# Altium schematic sheet Mako DSP Audio Codec R2.1.SchDoc
size B
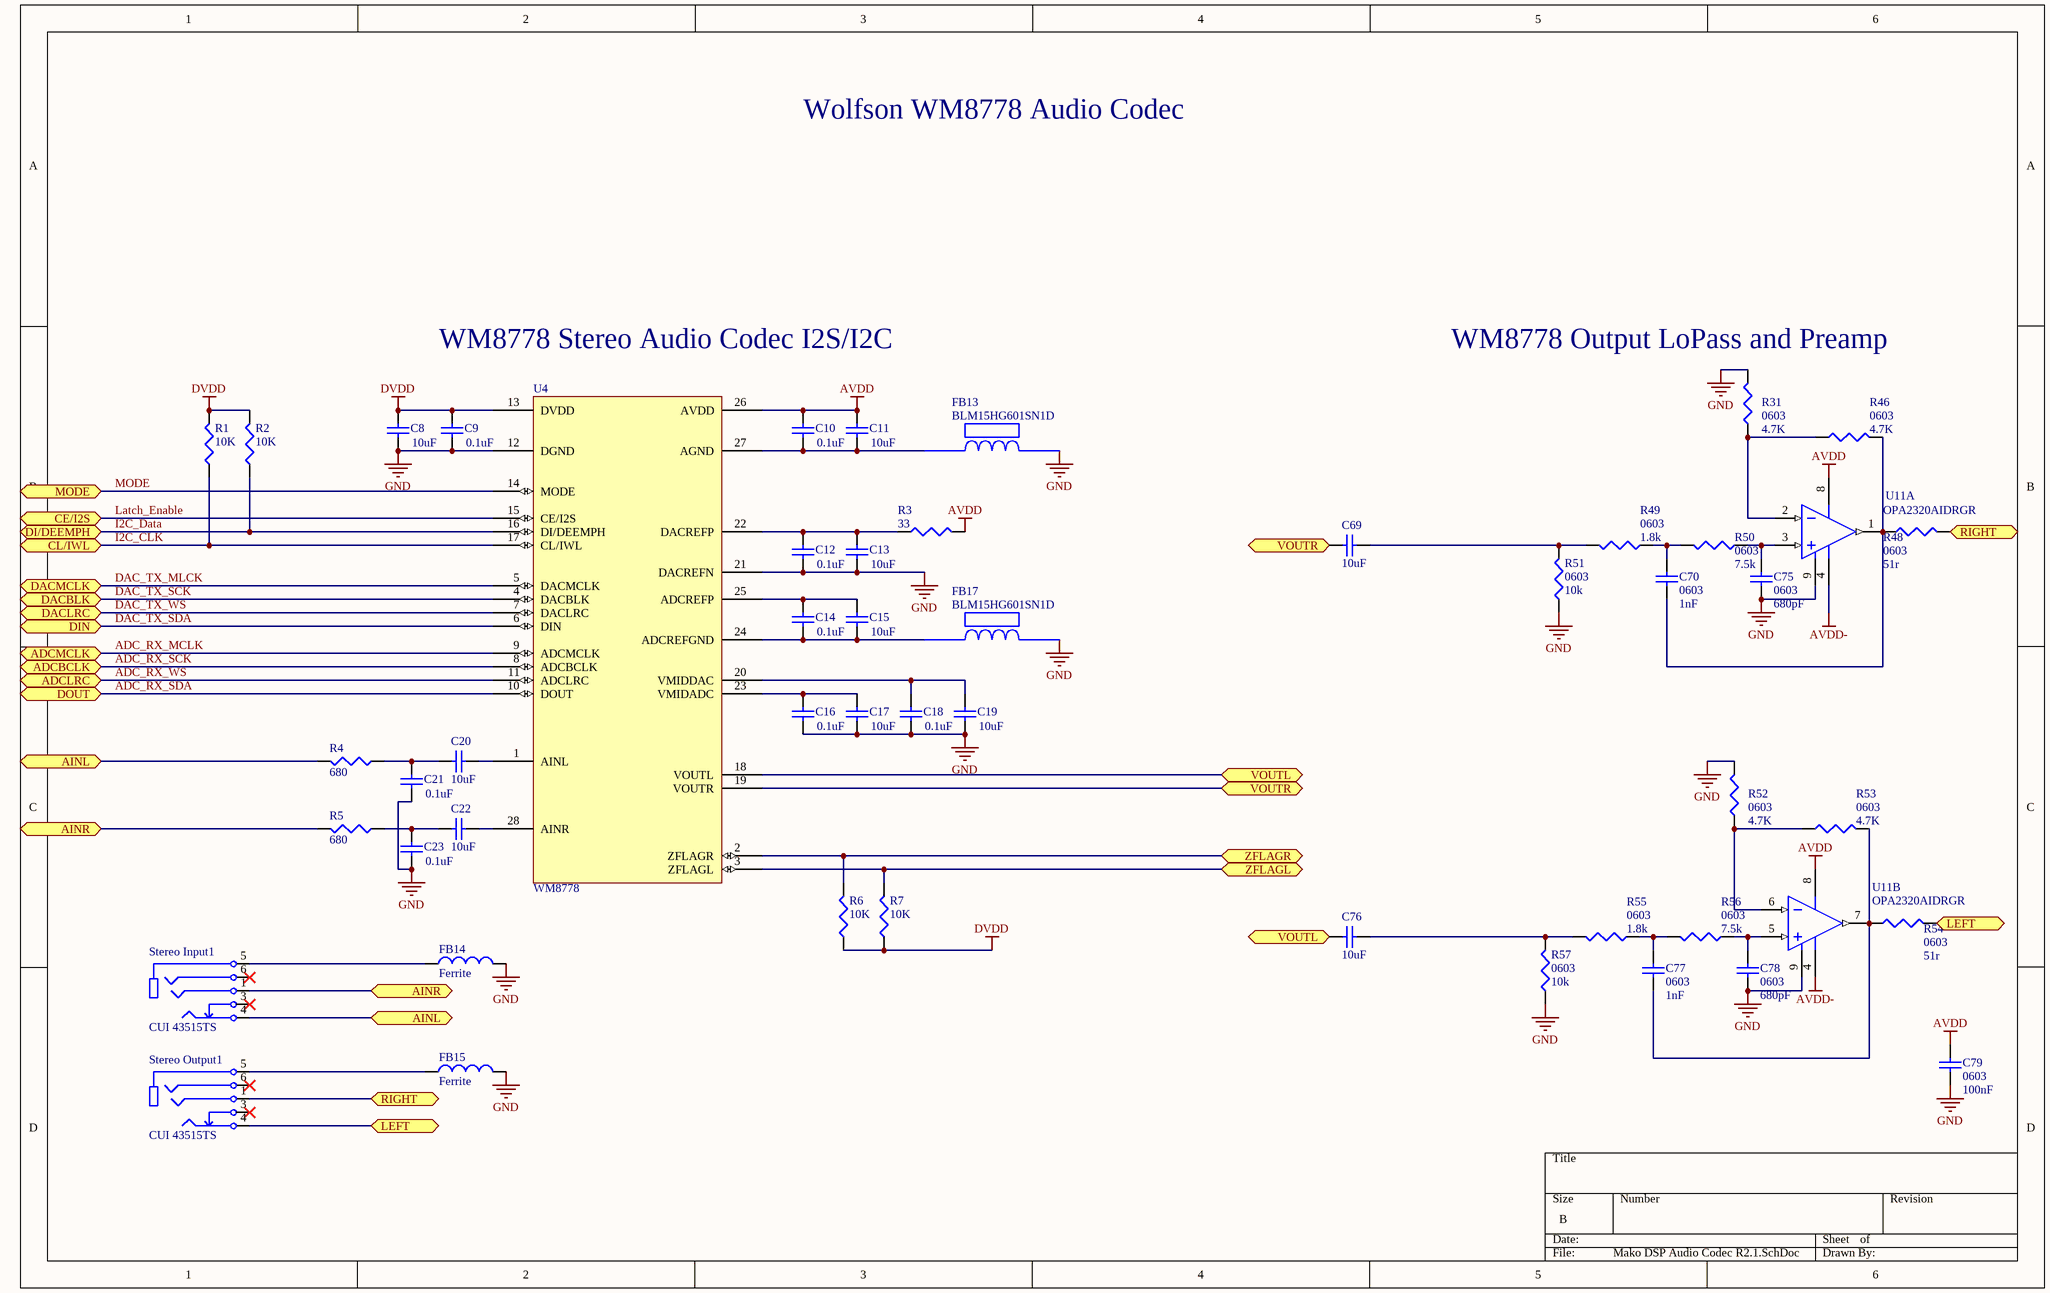
[diagram p0: Mako DSP Audio Codec R2.1.SchDoc]

## Parts
C8  value 10uF  [1608[0603]]  (hidden comment: Cap Semi)
C9  value 0.1uF  [1608[0603]]  (hidden comment: Cap Semi)
C10  value 0.1uF  [1608[0603]]  (hidden comment: Cap Semi)
C11  value 10uF  [1608[0603]]  (hidden comment: Cap Semi)
C12  value 0.1uF  [1608[0603]]  (hidden comment: Cap Semi)
C13  value 10uF  [1608[0603]]  (hidden comment: Cap Semi)
C14  value 0.1uF  [1608[0603]]  (hidden comment: Cap Semi)
C15  value 10uF  [1608[0603]]  (hidden comment: Cap Semi)
C16  value 0.1uF  [1608[0603]]  (hidden comment: Cap Semi)
C17  value 10uF  [1608[0603]]  (hidden comment: Cap Semi)
C18  value 0.1uF  [1608[0603]]  (hidden comment: Cap Semi)
C19  value 10uF  [1608[0603]]  (hidden comment: Cap Semi)
C20  value 10uF  [Panasonic VS B]  (hidden comment: Cap Semi)
C21  value 0.1uF  [SM 0805 - gap trimmed]  (hidden comment: Cap Semi)
C22  value 10uF  [Panasonic VS B]  (hidden comment: Cap Semi)
C23  value 0.1uF  [SM 0805 - gap trimmed]  (hidden comment: Cap Semi)
C69  value 10uF  [Panasonic VS B]  (hidden comment: Cap Semi)
C70  0603  value 1nF  [1608[0603]]
C75  0603  value 680pF  [1608[0603]]
C76  value 10uF  [Panasonic VS B]  (hidden comment: Cap Semi)
C77  0603  value 1nF  [1608[0603]]
C78  0603  value 680pF  [1608[0603]]
C79  0603  value 100nF  [1608[0603]]
FB13  BLM15HG601SN1D  [BLM18PG121SN1D]
FB14  Ferrite  [SM 0805 - gap trimmed]
FB15  Ferrite  [SM 0805 - gap trimmed]
FB17  BLM15HG601SN1D  [BLM18PG121SN1D]
R1  value 10K  [J1-0603]  (hidden comment: Res3)
R2  value 10K  [J1-0603]  (hidden comment: Res3)
R3  value 33  [J1-0603]  (hidden comment: Res3)
R4  value 680  [SM 0805 - gap trimmed]  (hidden comment: Res3)
R5  value 680  [SM 0805 - gap trimmed]  (hidden comment: Res3)
R6  value 10K  [J1-0603]  (hidden comment: Res3)
R7  value 10K  [J1-0603]  (hidden comment: Res3)
R31  0603  value 4.7K  [J1-0603]
R46  0603  value 4.7K  [J1-0603]
R48  0603  value 51r  [J1-0603]
R49  0603  value 1.8k  [J1-0603]
R50  0603  value 7.5k  [J1-0603]
R51  0603  value 10k  [J1-0603]
R52  0603  value 4.7K  [J1-0603]
R53  0603  value 4.7K  [J1-0603]
R54  0603  value 51r  [J1-0603]
R55  0603  value 1.8k  [J1-0603]
R56  0603  value 7.5k  [J1-0603]
R57  0603  value 10k  [J1-0603]
Stereo_Input1  CUI 43515TS  [CUI SJ-43515TS]
Stereo_Output1  CUI 43515TS  [CUI SJ-43515TS]
U4  WM8778  [WM8778]
U11  OPA2320AIDRGR  [TI-DRG8-2000X1200TP_V]  (parts A,B of 2)

## Ports
ADCBCLK (bidir), ADCLRC (bidir), ADCMCLK (bidir), AINL, AINR, CE/I2S (bidir), CL/IWL (bidir), DACBLK (bidir), DACLRC (bidir), DACMCLK (bidir), DI/DEEMPH (bidir), DIN (bidir), DOUT (bidir), LEFT, MODE (bidir), RIGHT, VOUTL, VOUTR, ZFLAGL (bidir), ZFLAGR (bidir)

## Nets
AVDD: C10.2 C11.2 C79.2 R3.2 U4.26(AVDD) U11.8(V+)
AVDD-: U11.4(V-)
DVDD: C8.2 C9.2 R1.2 R2.2 R6.1 R7.1 U4.13(DVDD)
GND: C8.1 C9.1 C12.1 C13.1 C16.1 C17.1 C18.1 C19.1 C21.1 C23.1 C75.1 C78.1 C79.1 FB13.2 FB14.2 FB15.2 FB17.2 R31.2 R51.1 R52.2 R57.1 U4.12(DGND) U4.21(DACREFN) U11.9(EP)
ADC_RX_MCLK: U4.9(ADCMCLK) ; port ADCMCLK
ADC_RX_SCK: U4.8(ADCBCLK) ; port ADCBCLK
ADC_RX_SDA: U4.10(DOUT) ; port DOUT
ADC_RX_WS: U4.11(ADCLRC) ; port ADCLRC
AINL: R4.2 Stereo_Input1.4(TIP) ; port AINL
AINR: R5.2 Stereo_Input1.1(R1) ; port AINR
DAC_TX_MLCK: U4.5(DACMCLK) ; port DACMCLK
DAC_TX_SCK: U4.4(DACBLK) ; port DACBLK
DAC_TX_SDA: U4.6(DIN) ; port DIN
DAC_TX_WS: U4.7(DACLRC) ; port DACLRC
I2C_CLK: R1.1 U4.17(CL/IWL) ; port CL/IWL
I2C_Data: R2.1 U4.16(DI/DEEMPH) ; port DI/DEEMPH
Latch_Enable: U4.15(CE/I2S) ; port CE/I2S
LEFT: R54.2 Stereo_Output1.4(TIP) ; port LEFT
MODE: U4.14(MODE) ; port MODE
RIGHT: R48.2 Stereo_Output1.1(R1) ; port RIGHT
VOUTL: C76.1 U4.18(VOUTL) ; port VOUTL
VOUTR: C69.1 U4.19(VOUTR) ; port VOUTR
ZFLAGL: R7.2 U4.3(ZFLAGL) ; port ZFLAGL
ZFLAGR: R6.2 U4.2(ZFLAGR) ; port ZFLAGR
NetC10_1: C10.1 C11.1 FB13.1 U4.27(AGND)
NetC12_2: C12.2 C13.2 R3.1 U4.22(DACREFP)
NetC14_1: C14.1 C15.1 FB17.1 U4.24(ADCREFGND)
NetC14_2: C14.2 C15.2 U4.25(ADCREFP)
NetC16_2: C16.2 C17.2 U4.23(VMIDADC)
NetC18_2: C18.2 C19.2 U4.20(VMIDDAC)
NetC20_1: C20.1 U4.1(AINL)
NetC20_2: C20.2 C21.2 R4.1
NetC22_1: C22.1 U4.28(AINR)
NetC22_2: C22.2 C23.2 R5.1
NetC69_2: C69.2 R49.2 R51.2
NetC70_1: C70.1 R46.2 R48.1 U11.1(OUT_A)
NetC70_2: C70.2 R49.1 R50.2
NetC75_2: C75.2 R50.1 U11.3(IN_A+)
NetC76_2: C76.2 R55.2 R57.2
NetC77_1: C77.1 R53.2 R54.1 U11.7(OUT_B)
NetC77_2: C77.2 R55.1 R56.2
NetC78_2: C78.2 R56.1 U11.5(IN_B+)
NetFB14_1: FB14.1 Stereo_Input1.5(SLEEVE)
NetFB15_1: FB15.1 Stereo_Output1.5(SLEEVE)
NetR31_1: R31.1 R46.1 U11.2(IN_A-)
NetR52_1: R52.1 R53.1 U11.6(IN_B-)

Not connected (* = marked no-connect by the designer): Stereo_Input1 3(TS)* 6(R2)*; Stereo_Output1 3(TS)* 6(R2)*

## Notes on the sheet
- Wolfson WM8778 Audio Codec
- WM8778 Stereo Audio Codec I2S/I2C
- (near R31) WM8778 Output LoPass and Preamp

## Library data of the parts
C8-C23 C69 C70 C75-C79 = Cap Semi: Capacitor (Semiconductor SIM Model); Published: 8-Jun-2000; LatestRevisionDate: 29-May-2009; LatestRevisionNote: IPC-7351 Footprint Added.; PackageReference: C1206; Publisher: Altium Limited; PackageDescription: Chip Capacitor
FB14 FB15 = Inductor: Code_IEC: 1005; Published: 8-Jun-2000; LatestRevisionDate: 17-Jul-2002; LatestRevisionNote: Re-released for DXP Platform.; PackageReference: 0402-A; Publisher: Altium Limited; Code_JEITA: 0402
R1-R7 R31 R46 R48-R57 = Res3: Resistor; Published: 8-Jun-2000; LatestRevisionDate: 29-May-2009; LatestRevisionNote: IPC-7351 Footprint Added.; PackageReference: J1-0603; Publisher: Altium Limited; PackageDescription: Chip Resistor
U11 = OPA2320AIDRGR: Precision, 20 MHz, 0.9 pA Ib, RRIO, CMOS Operational Amplifier, 1.8 to 5.5 V, -40 to 125 degC, 8-pin SON (DRG8), Green (RoHS & no Sb/Br); Manufacturer: Texas Instruments; CMRR(Min)(dB): 100; IIB(Max)(pA): 400; Iq per channel(Max)(mA): 1.6; Number of Channels: 2; Offset Drift(Typ)(uV/C): 1.5; Slew Rate(Typ)(V/us): 10; Sub Family: High Output Current Amplifier (>=50mA), Low Input Bias Current Amp (<=10pA), Low Noise Amp (<=10nV/rtHz), Low Offset Voltage Amplifier (<=500uV), Low Supply Voltage Amplifier (<=2.7V), Precision Amplifier; Total Supply Voltage(Max)(+5V is 5, +/-5V is 10): 5.5; Total Supply Voltage(Min)(+5V is 5, +/-5V is 10): 1.8; Vio (25C)(Max)(mV): 0.15; Vn at 1kHz(Typ)(nV/rtHz): 8.5; DatasheetVersion: SBOS513D; PackageVersion: 4205379/C, 12/2010; PackageReference: DRG8-2000X1200TP; PackageDescription: 8-Pin Plastic Small Outline, Body 3 x 3 mm, Pitch 0.5 mm; Supplier 1: Digi-Key; Supplier Part Number 1: OPA2320AIDRGR-ND; Supplier 2: Mouser; Supplier Part Number 2: 595-OPA2320AIDRGR; Eco-Plan: Green (RoHS & no Sb/Br); Mounting Technology: Surface Mount; Code_JEDEC: MO-229; PartNumber: OPA2320AIDRGR; ComponentLink1Description: Manufacturer URL; ComponentLink1URL: http://www.ti.com/; ComponentLink2Description: Datasheet; ComponentLink2URL: http://www.ti.com/general/docs/lit/getliterature.tsp?genericPartNumber=OPA2320&fileType=pdf; ComponentLink3Description: Package Specification; ComponentLink3URL: http://www.ti.com/litv/pdf/mpds151b